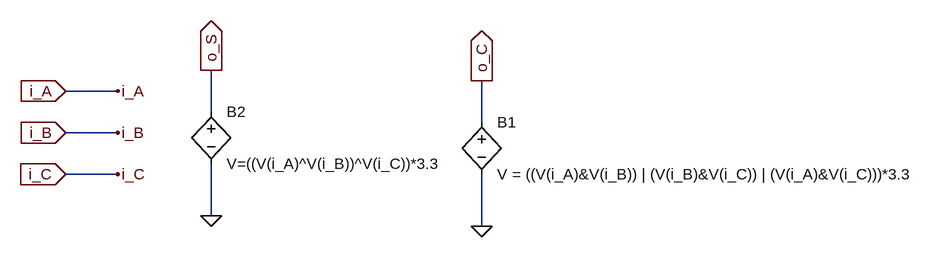
[diagram p0: schematic FA.asc]
FA.asc, the LTspice schematic file:
Version 4
SHEET 1 1380 680
WIRE 112 128 32 128
WIRE 256 160 256 96
WIRE 672 176 672 112
WIRE 112 192 32 192
WIRE 112 256 32 256
WIRE 256 320 256 240
WIRE 672 336 672 256
FLAG 672 336 0
FLAG 256 320 0
FLAG 672 112 o_C
IOPIN 672 112 Out
FLAG 256 96 o_S
IOPIN 256 96 Out
FLAG 32 128 i_A
IOPIN 32 128 In
FLAG 32 192 i_B
IOPIN 32 192 In
FLAG 32 256 i_C
IOPIN 32 256 In
FLAG 112 128 i_A
FLAG 112 192 i_B
FLAG 112 256 i_C
SYMBOL bv 672 160 R0
SYMATTR InstName B1
SYMATTR Value V = ((V(i_A)&V(i_B)) | (V(i_B)&V(i_C)) | (V(i_A)&V(i_C)))*3.3
SYMBOL bv 256 144 R0
SYMATTR InstName B2
SYMATTR Value V=((V(i_A)^V(i_B))^V(i_C))*3.3

The netlist it stands for:
* FA.asc
B1 o_C 0 V = ((V(i_A)&V(i_B)) | (V(i_B)&V(i_C)) | (V(i_A)&V(i_C)))*3.3
B2 o_S 0 V=((V(i_A)^V(i_B))^V(i_C))*3.3
.backanno
.end